# Altium schematic sheet PAGE2-POWER.SchDoc (part 2 of 2)
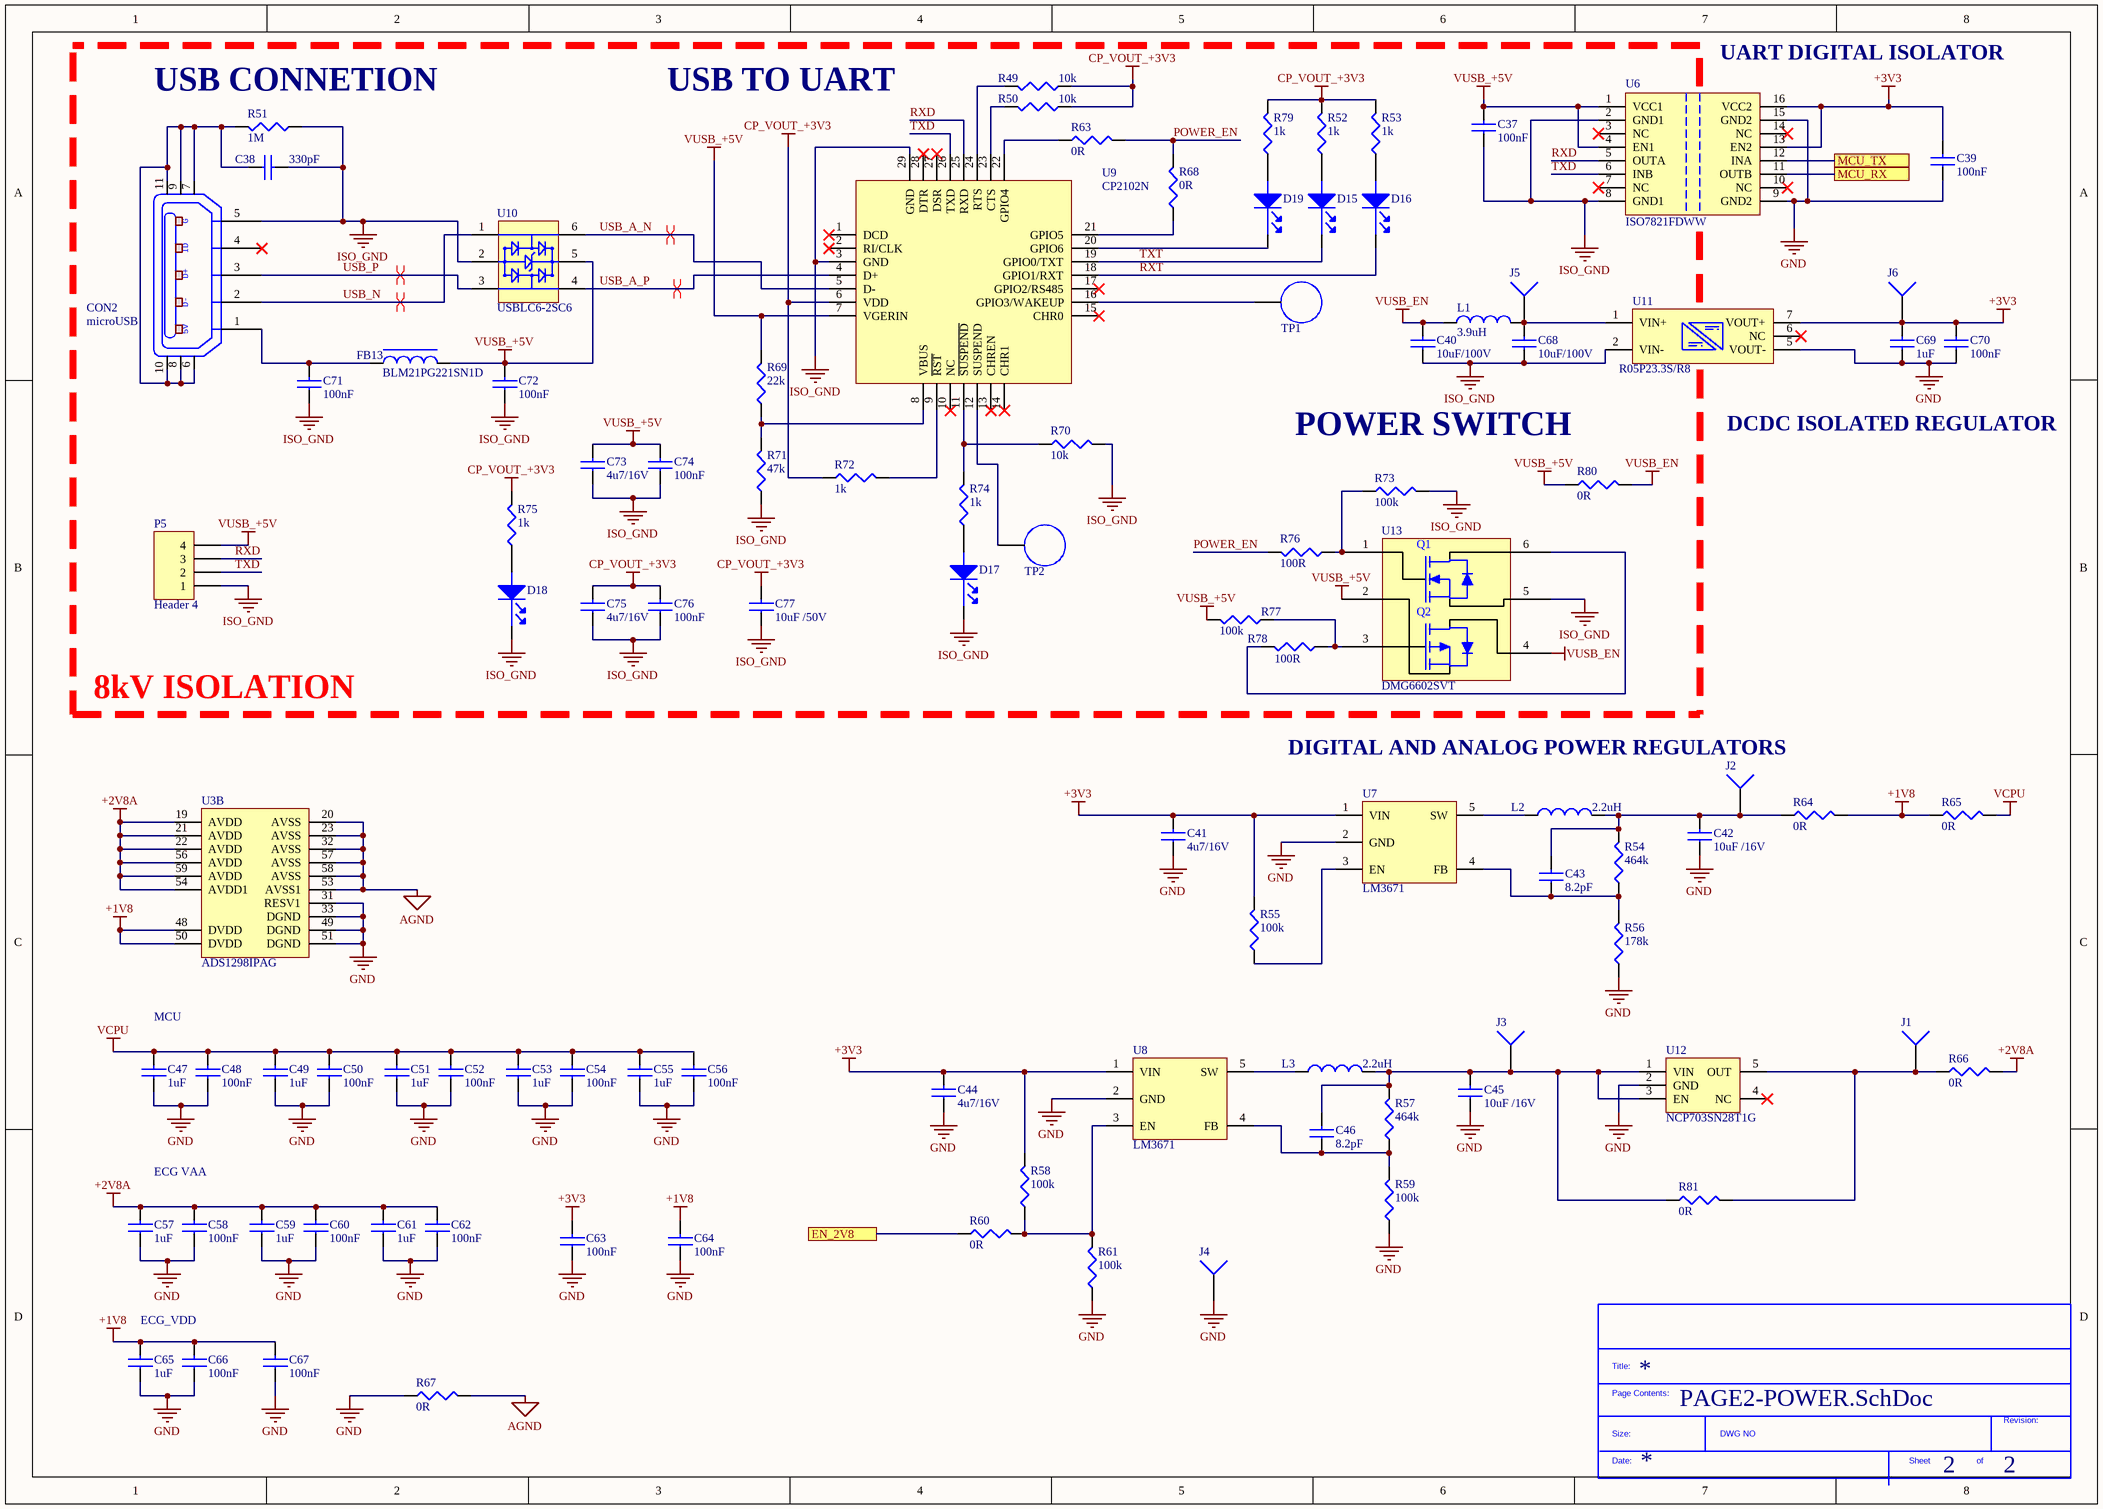
[diagram p1: PAGE2-POWER.SchDoc]

## Library data of the parts
C37 C39 C48 C50 C52 C54 C56 C58 C60 C62-C64 C66 C67 C70-C72 C74 C76 = 100nF: MURATA - GRM188R71C104KA01J - CAP, MLCC, X7R, 0.1UF, 16V, 0603; Ceramic Capacitor Case: 0603 [1608 Metric]; Capacitance: 0.1; Voltage Rating: 16; Capacitance Tolerance: ± 10%; Dielectric Characteristic: X7; Product Range: GRM Series; SVHC: No SVHC (20-Jun-2016; Supplier 1: Farnell; Manufacturer: MURATA; Manufacturer Part Number: GRM188R71C104KA01J; RoHS: YES; Stock 1: 18297; Pricing 1: 10=0.0145, 100=0.0126, 500=0.0081, 2500=0.0059, 5000=0.0052, 10000=0.0046, 50000=0.0036, 100000=0.0035 (GBP); Packaging: Cut Tape; Operating Temperature Min: -55; Operating Temperature Max: 125; Automotive Qualification Standard: -; MSL: MSL 1 - Unlimited; ComponentLink1URL: http://www.farnell.com/datasheets/2189124.pdf; ComponentLink1Description: http://www.farnell.com/datasheets/2189124.pdf; Supplier Part Number 1: 2688519
C38 = 330pF: Cap Ceramic 330pF 50V C0G 5% SMD 0603 125C Paper T/R; Manufacturer: Walsin Technologies; Manufacturer Part Number: 0603N331J500CT; Supplier 1: Farnell; Stock 1: 9688; Pricing 1: 10=0.066, 100=0.0446, 500=0.0195, 1000=0.0138 (GBP); Case/Package: 0603; Case Code (Metric): 1608; Case Code (Imperial): 0603; Min Operating Temperature: -55°C; Max Operating Temperature: 125°C; Packaging: Tape and Reel; Capacitance: 330pF; Tolerance: 5%; Dielectric: C0G; Voltage Rating: 50V; Voltage Rating (DC): 50V; Length: 1.6mm; Depth: 0.8mm; Radiation Hardening: No; REACH SVHC: Unknown; Supplier Part Number 1: 2496902
C40 C68 = 10uF/100V/2220: 10µF 100V Ceramic Capacitor X7R 2220 (5750 Metric) 0.224" L x 0.197" W (5.70mm x 5.00mm); Manufacturer: Kyocera AVX; Manufacturer Part Number: 22201C106MAT2A; Capacitance: 10uF; Tolerance: 20%; Supplier 1: Digi-Key; Stock 1: 5000; Pricing 1: 1=2.58, 10=2.087, 100=1.5939 (USD); Mount: Surface Mount; Case/Package: 2220; Case Code (Metric): 5750; Case Code (Imperial): 2220; Min Operating Temperature: -55°C; Max Operating Temperature: 125°C; Packaging: Tape and Reel; Voltage Rating: 100V; Dielectric: X7R; Voltage Rating (DC): 100V; Length: 0.224inch; Width: 0.197inch; Thickness: 0.11inch; Supplier Part Number 1: 478-9622-6-ND
C41 C44 C73 C75 = 4u7  16V 0603: MURATA - GRM188R61C475KAAJD - CAP, MLCC, X5R, 4.7UF, 16V, 0603; Ceramic Capacitor Case: 0603 [1608 Metric]; Capacitance: 4.7; Voltage Rating: 16; Capacitance Tolerance: ± 10%; Dielectric Characteristic: X5; Product Range: GRM Series; SVHC: No SVHC (17-Dec-2015)<!--FANDB--><div class="features-and-benefits-container"><div class="features-and-benefits-desc-container"><span class="features-and-benefits-container-desc">SMD Multilayer Ceramic Capacitor, 0603 [1608 Metric], 4.7 µF, 16 V, ± 10%, X5; Supplier 1: Farnell; Manufacturer: MURATA; Manufacturer Part Number: GRM188R61C475KAAJD; RoHS: YES; Stock 1: 5038; Pricing 1: 10=0.16, 100=0.0929, 500=0.076, 1000=0.0618, 2000=0.0605, 4000=0.0425, 20000=0.0409, 40000=0.0355 (GBP); Packaging: Cut Tape; Operating Temperature Min: -55; Operating Temperature Max: 85; Automotive Qualification Standard: -; MSL: MSL 1 - Unlimited; ComponentLink1URL: http://www.farnell.com/datasheets/2079168.pdf; ComponentLink1Description: http://www.farnell.com/datasheets/2079168.pdf; Supplier Part Number 1: 2611924
C42 C45 = 10uF /16V: TDK - CGA4J1X5R1C106K125AC - CAP, MLCC, X5R, 10UF, 16V, 0805; Supplier 1: Farnell; Manufacturer: TDK; Manufacturer Part Number: CGA4J1X5R1C106K125AC; RoHS: YES; Stock 1: 8974; Pricing 1: 5=0.41, 50=0.146, 250=0.131, 500=0.12, 1000=0.103 (GBP); ComponentLink1URL: http://bcove.me/e1v54mtm; ComponentLink1Description: http://bcove.me/e1v54mtm; ComponentLink2URL: http://www.farnell.com/datasheets/1936565.pdf; ComponentLink2Description: http://www.farnell.com/datasheets/1936565.pdf; ComponentLink3URL: http://www.farnell.com/datasheets/1683658.pdf; ComponentLink3Description: http://www.farnell.com/datasheets/1683658.pdf; Supplier Part Number 1: 2210948RL
C43 C46 = 8.2pF: CAPACITOR, 0603, 8.2PF, 50V; Manufacturer: Yageo; Manufacturer Part Number: CC0603DRNPO9BN8R2; Dielectric Material: Ceramic; Tolerance: 5%; Temperature Coefficient: 30ppm/°C; Dielectric: C0G; Insulation Resistance: 100GR; Supplier 1: Farnell; Stock 1: 34581; Pricing 1: 10=0.0422, 100=0.0281, 500=0.0211, 1000=0.0169, 2000=0.0141, 4000=0.0121, 20000=0.0077 (EUR); Mount: Surface Mount; Case/Package: 0603; Number of Pins: 2; Case Code (Imperial): 0603; Case Code (Metric): 1608; Min Operating Temperature: -55°C; Max Operating Temperature: 125°C; Packaging: Tape and Reel; Package Quantity: 4000; Termination: SMD/SMT; Voltage Rating: 50V; Composition: Ceramic; Capacitance: 8.2pF; Voltage Rating (DC): 50V; Length: 1.6mm; Height: 0.8mm; Width: 0.8mm; Depth: 0.8mm; Thickness: 0.035inch; Radiation Hardening: No; REACH SVHC: No SVHC; Lead Free: Lead Free; ComponentLink1URL: https://datasheet.ciiva.com/11586/upy-gp-np0-16v-to-50v-8-11586455.pdf; ComponentLink1Description: https://datasheet.ciiva.com/11586/upy-gp-np0-16v-to-50v-8-11586455.pdf; ComponentLink2URL: https://datasheet.ciiva.com/13210/upy-gp-np0-16v-to-50v-8-13210824.pdf; ComponentLink2Description: https://datasheet.ciiva.com/13210/upy-gp-np0-16v-to-50v-8-13210824.pdf; ComponentLink3URL: https://datasheet.ciiva.com/8033/1443161-8033709.pdf; ComponentLink3Description: https://datasheet.ciiva.com/8033/1443161-8033709.pdf; ComponentLink4URL: https://datasheet.ciiva.com/17437/upy-gp-np0-16v-to-50v-8-17437117.pdf; ComponentLink4Description: https://datasheet.ciiva.com/17437/upy-gp-np0-16v-to-50v-8-17437117.pdf; ComponentLink5URL: https://datasheet.ciiva.com/8033/1443161-8033711.pdf; ComponentLink5Description: https://datasheet.ciiva.com/8033/1443161-8033711.pdf; Supplier Part Number 1: 721955
C47 C49 C51 C53 C55 C57 C59 C61 C65 C69 = 1uF: MURATA - GRM188R61H105KAALD - CAP, MLCC, X5R, 1UF, 50V, 0603; Ceramic Capacitor Case: 0603 [1608 Metric]; Capacitance: 1; Voltage Rating: 50; Capacitance Tolerance: ± 10%; Dielectric Characteristic: X5; Product Range: GRM Series; SVHC: No SVHC (17-Dec-2015); Capacitor Terminals: SMD<!--FANDB--><div class="features-and-benefits-container"><div class="features-and-benefits-description"><span class="features-benefits-value">The Murata GRM series capacitors are Multilayer Ceramic Chip Capacitors (MLCC) used for general purpose applications. These MLCC capacitors are classified into temperature compensating and high dielectric constant types depending on the change in electrostatic capacitance due to change in temperature. The temperature compensating capacitors feature a small rate of change in electrostatic capacitance as the temperature changes and are used for applications such as filters and high frequency circuit matching. The high dielectric constant capacitors use materials with a high dielectric constant and feature a large electrostatic capacitance. Typical applications are power supply decoupling and smoothing circuits.</span></div><div class="features-and-benefits-list"><ul class="features-and-benefits-list-list"><li class="features-and-benefits-list-item">Large capacity and small size in a multilayer structure</li><li class="features-and-benefits-list-item">Capacitance value ranging from 0.1pF to 220?F</li><li class="features-and-benefits-list-item">Tin plated external electrodes, excellent solderability</li><li class="features-and-benefits-list-item">Provides good high frequency characteristics</li><li class="features-and-benefits-list-item">Excellent pulse response</li><li class="features-and-benefits-list-item">High reliability</li><li class="features-and-benefits-list-item">Capacitor size varies from 0.4×0.2mm to 5.7×5.0mm</li><li class="features-and-benefits-list-item">Rated voltage of 2.5VDC to 3.15; Supplier 1: Farnell; Manufacturer: MURATA; Manufacturer Part Number: GRM188R61H105KAALD; RoHS: YES; Stock 1: 62682; Pricing 1: 10=0.093, 100=0.062, 500=0.0507, 1000=0.0465, 2000=0.0429, 4000=0.0399, 20000=0.0372, 40000=0.0365 (GBP); Packaging: Cut Tape; Operating Temperature Min: -55; Operating Temperature Max: 85; Automotive Qualification Standard: -; MSL: -; Capacitance Tolerance ±: ± 10%; ComponentLink1URL: http://www.farnell.com/datasheets/2048611.pdf; ComponentLink1Description: http://www.farnell.com/datasheets/2048611.pdf; Supplier Part Number 1: 1845736
C77 = 10uF /50V: MURATA - GRM31CR61H106KA12L - CAP, MLCC, X5R, 10UF, 50V, 1206; Supplier 1: Farnell; Manufacturer: MURATA; Manufacturer Part Number: GRM31CR61H106KA12L; RoHS: YES; Stock 1: 51830; Pricing 1: 5=0.368, 50=0.214, 250=0.196, 500=0.178, 1000=0.159 (GBP); ComponentLink1URL: http://www.farnell.com/datasheets/2048767.pdf; ComponentLink1Description: http://www.farnell.com/datasheets/2048767.pdf; Supplier Part Number 1: 1845762
CON2 = Micro USB CHINA 1
D15-D19 = LED RED: BROADCOM LIMITED - HSMS-C190 - LED, RED, 10MCD, 626NM; LED Mounting: SMD; Forward Current If: 20; Forward Voltage: 2.1; Wavelength Typ: 626; Luminous Intensity: 10; Viewing Angle: 170°; Lens Shape: Rectangular; SVHC: No SVHC (17-Dec-2015)<!--FANDB--><div class="features-and-benefits-container"><div class="features-and-benefits-description"><span class="features-benefits-value">The HSMS-C190 is a HER SMD Chip LED with untinted/diffused lens, made of GaP. It is designed in an industry standard package 1.6 x 0.8mm footprint with 0.8mm profile. It is compatible with IR reflow solder processes. The small size and wide viewing angle make this LED prime choices for backlighting applications and front panel illumination especially where space is a premium.</span></div><div class="features-and-benefits-list"><ul class="features-and-benefits-list-list"><li class="features-and-benefits-list-item">Small size</li><li class="features-and-benefits-list-item">Industry standard footprint</li><li class="features-and-benefits-list-item">Compatible with IR solder</li><li class="features-and-benefits-list-item">Diffused optics</li><li class="features-and-benefits-list-item">-40 to 85; Supplier 1: Farnell; Manufacturer: BROADCOM LIMITED; Manufacturer Part Number: HSMS-C190; RoHS: YES; Stock 1: 7534; Pricing 1: 1=0.361, 10=0.256, 50=0.235, 100=0.106, 200=0.101 (GBP); LED Colour: Red; Bulb Size: -; Packaging: Cut Tape; Product Range: -; Automotive Qualification Standard: -; MSL: -; ComponentLink1URL: http://www.farnell.com/datasheets/313031.pdf; ComponentLink1Description: http://www.farnell.com/datasheets/313031.pdf; ComponentLink2URL: http://www.farnell.com/datasheets/1681524.pdf; ComponentLink2Description: http://www.farnell.com/datasheets/1681524.pdf; ComponentLink3URL: http://www.farnell.com/datasheets/2165483.pdf; ComponentLink3Description: http://www.farnell.com/datasheets/2165483.pdf; Supplier Part Number 1: 2497356
FB13 = BLM21PG221SN1D: FERRITE CHIP 220 OHM 0805; Manufacturer: Murata; Material: Ferrite,Steel; Impedance: 220R; Tolerance: 25%; Max Current Rating: 2A; Number of Lines: 1; DC Resistance (DCR): 45mR; Test Frequency: 100MHz; Shielding: Unshielded; Supplier 1: Farnell; Manufacturer Part Number: BLM21PG221SN1D; Stock 1: 8102; Pricing 1: 10=0.0521, 100=0.0337, 500=0.0251, 1000=0.0207, 2000=0.0196, 4000=0.0156, 20000=0.0145 (GBP); Case/Package: 0805; Number of Pins: 2; Core Material: Ferrite; Case Code (Metric): 2012; Case Code (Imperial): 0805; Contact Plating: Matte,Tin; Min Operating Temperature: -55°C; Max Operating Temperature: 125°C; Package Quantity: 1; Packaging: Tape and Reel; Current Rating: 2A; Max DC Current: 2A; Termination: SMD/SMT; DC Current: 2A; Military Standard: Not; Frequency: 100MHz; Number of Circuits: 1; Current: 2A; Length: 2mm; Height: 0.85mm; Width: 1.25mm; Depth: 1.25mm; Radiation Hardening: No; REACH SVHC: No SVHC; Lead Free: Lead Free; ComponentLink1URL: https://www.murata.com/en-us/products/productdata/8796738977822/ENFA0005.pdf; ComponentLink1Description: https://www.murata.com/en-us/products/productdata/8796738977822/ENFA0005.pdf; ComponentLink2URL: http://uk.rs-online.com/webdocs/1388/0900766b813885e8.pdf; ComponentLink2Description: http://uk.rs-online.com/webdocs/1388/0900766b813885e8.pdf; ComponentLink3URL: https://www.distrelec.biz/Web/Downloads/ta/_e/anBLM21P_Data_E.pdf?mime=application%2Fpdf; ComponentLink3Description: https://www.distrelec.biz/Web/Downloads/ta/_e/anBLM21P_Data_E.pdf?mime=application%2Fpdf; ComponentLink4URL: http://search.murata.co.jp/Ceramy/image/img/PDF/ENG/L0110S0100BLM21P.pdf; ComponentLink4Description: http://search.murata.co.jp/Ceramy/image/img/PDF/ENG/L0110S0100BLM21P.pdf; ComponentLink5URL: http://www.farnell.com/datasheets/1756152.pdf; ComponentLink5Description: http://www.farnell.com/datasheets/1756152.pdf; ComponentLink6URL: http://www.jameco.com/Jameco/Products/ProdDS/1845321.pdf; ComponentLink6Description: http://www.jameco.com/Jameco/Products/ProdDS/1845321.pdf; ComponentLink7URL: http://www.produktinfo.conrad.com/datenblaetter/425000-449999/442529-da-01-en-CHIP_DROSSEL_0805_220R_2000MA_2_0X1_25MM.pdf; ComponentLink7Description: http://www.produktinfo.conrad.com/datenblaetter/425000-449999/442529-da-01-en-CHIP_DROSSEL_0805_220R_2000MA_2_0X1_25MM.pdf; Supplier Part Number 1: 1515661
L1 = 3.9uH/1.32A: WURTH ELEKTRONIK         7440450039             Surface Mount Power Inductor, WE-LQ Series, 3.9 H, 1.32 A, 2.5 A, Unshielded, 0.14 ohm; Manufacturer: Wurth Electronics; Core Material: Ferrite; Inductance Tolerance: 20%; Q Factor: 40; Self Resonant Frequency: 54MHz; Current Rating: 1.32A; Saturation Current: 2.5A; DC Resistance (DCR): 140mR; Test Frequency: 1MHz; Supplier 1: Digi-Key; Manufacturer Part Number: 7440450039; Stock 1: 541; Pricing 1: 1=0.8, 10=0.786, 50=0.728, 100=0.67, 250=0.612 (USD); Mount: Surface Mount; Case/Package: 1812; Case Code (Metric): 4532; Case Code (Imperial): 1812; Min Operating Temperature: -40°C; Max Operating Temperature: 125°C; Package Quantity: 1; Tolerance: 20%; Shielding: Unshielded; Packaging: Cut Tape; Composition: Wirewound; Inductance: 3.9uh; Max DC Current: 1.32A; Termination: SMD/SMT; RMS Current (Irms): 1.32A; Length: 0.177inch; Height: 2.6mm; Width: 0.126inch; Height - Seated (Max): 0.114inch; REACH SVHC: Unknown; ComponentLink1URL: http://www.farnell.com/datasheets/1735423.pdf; ComponentLink1Description: http://www.farnell.com/datasheets/1735423.pdf; ComponentLink2URL: http://katalog.we-online.de/pbs/datasheet/7440450039.pdf; ComponentLink2Description: http://katalog.we-online.de/pbs/datasheet/7440450039.pdf; ComponentLink3URL: http://www.mouser.com/ds/2/445/7440450039-538340.pdf; ComponentLink3Description: http://www.mouser.com/ds/2/445/7440450039-538340.pdf; Supplier Part Number 1: 732-4063-1-ND
L2 L3 = 2.2 uH 900mA: Manufacturer: Bourns; Manufacturer Part Number: SRN2009T-2R2M; Supplier 1: Farnell; Stock 1: 1975; Pricing 1: 5=0.308, 50=0.201, 250=0.163, 500=0.145, 1000=0.133, 2000=0.124, 10000=0.116 (EUR); Supplier Part Number 1: 2808272
P5 = Header 4: Header, 4-Pin; LatestRevisionDate: 17-Jul-2002; LatestRevisionNote: Re-released for DXP Platform.; Publisher: Altium Limited
R49 R50 R70 = 10k: MULTICOMP - MCMR06X103 JTL - RES, CERAMIC, 10K, 5%, 0.1W, 0603; Resistance: 10; Voltage Rating: 75; Resistor Case Style: 0603 [1608 Metric]; Power Rating: 100; Product Range: MCMR Series; Temperature Coefficient: ± 100; Automotive Qualification Standard: -<!--FANDB--><div class="features-and-benefits-container"><div class="features-and-benefits-description"><span class="features-benefits-value">The Multicomp MCMR series resistors are automotive grade, anti sulphured thick film chip resistor. The resistance range includes E24 and E96 decade values from 1ohm to 10Mohm. These resistors are constructed on top of a high grade ceramic body.</span></div><div class="features-and-benefits-list"><ul class="features-and-benefits-list-list"><li class="features-and-benefits-list-item">EIA 0402, 0603, 0805, 1206 chip sizes available</li><li class="features-and-benefits-list-item">High reliability and stability</li><li class="features-and-benefits-list-item">Automotive grade AEC-Q200 compliant</li><li class="features-and-benefits-list-item">Complaint with (IEC 60068-1) 55/155/56 climatic category</li><li class="features-and-benefits-list-item">Maximum operation voltage of 50V, 75V, 150V and 200V</li><li class="features-and-benefits-list-item">Power rating of 62.5mW, 100mW, 125mW and 250mW</li><li class="features-and-benefits-list-item">Available in ±1% and ±5% tolerance</li><li class="features-and-benefits-list-item">Temperature coefficient (TCR) of +200ppm/°C, +100ppm/°C and -200ppm/°C to +400ppm/°C</li><li class="features-and-benefits-list-item">Operating temperature range -55°C to 155; Supplier 1: Farnell; Manufacturer: MULTICOMP; Manufacturer Part Number: MCMR06X103 JTL; RoHS: Y-EX; Stock 1: 19791; Pricing 1: 10=0.0087, 100=0.0074, 500=0.0061, 1000=0.0048, 2500=0.0032, 5000=0.0024, 25000=0.0016, 50000=0.0013 (GBP); Resistance Tolerance: ± 5%; Packaging: Cut Tape; Resistor Element Material: Ceramic; ComponentLink1URL: http://www.farnell.com/datasheets/1716707.pdf; ComponentLink1Description: http://www.farnell.com/datasheets/1716707.pdf; Supplier Part Number 1: 2073356
R51 = 1M: MULTICOMP - MC0063W060311M - RES, THICK FILM, 1M, 1%, 0.063W, 0603; Resistance: 1; Voltage Rating: 50; Resistor Case Style: 0603 [1608 Metric]; Power Rating: 63; Product Range: MC Series; Temperature Coefficient: ± 100; SVHC: No SVHC (17-Dec-2015); External Depth: 0.45; External Length / Height: 1.6; External Width: 0.8; No. of Pins: 2; Reel Quantity: 5000; Resistor Mounting: Surface Mount Device; Temperature Coeff. +: 100; Voltage Rating V DC: 50V<!--FANDB--><div class="features-and-benefits-container"><div class="features-and-benefits-description"><span class="features-benefits-value">The Multicomp MC series current sense resistors are thick film chip resistors. The resistance range includes E96 and E24 decade values from 1ohm to 10Mohm.</span></div><div class="features-and-benefits-list"><ul class="features-and-benefits-list-list"><li class="features-and-benefits-list-item">EIA 0402, 0603, 0805, 1206 chip sizes available</li><li class="features-and-benefits-list-item">Small size and low weight</li><li class="features-and-benefits-list-item">Suitable for both wave and reflow soldering</li><li class="features-and-benefits-list-item">Reduction of assembly costs</li><li class="features-and-benefits-list-item">Maximum working voltage of 50V(0402, 0603), 150V(0805), 200V(1206)</li><li class="features-and-benefits-list-item">Available in ±1%, ±2% and ±5% tolerance</li><li class="features-and-benefits-list-item">Power rating of 62.5mW, 100mW and 125mW</li><li class="features-and-benefits-list-item">±400ppm/°C(1ohm to 10ohm), ±200ppm/°C(11ohm to 100ohm), ±100; Supplier 1: Farnell; Manufacturer: MULTICOMP; Manufacturer Part Number: MC0063W060311M; RoHS: Y-EX; Stock 1: 333415; Pricing 1: 10=0.0011, 100=0.001, 500=0.0009, 1000=0.0008, 2500=0.0007 (GBP); Resistance Tolerance: ± 1%; Packaging: Cut Tape; Resistor Element Material: Thick Film; Automotive Qualification Standard: -; Operating Temperature Max: 155; Operating Temperature Min: -55; Operating Temperature Range: -55°C to +155; Tape Width: 8; Temperature Coeff. -: 100; Tolerance +: 1%; Tolerance -: 1%; ComponentLink1URL: http://www.farnell.com/datasheets/1788326.pdf; ComponentLink1Description: http://www.farnell.com/datasheets/1788326.pdf; ComponentLink2URL: http://www.farnell.com/cad/1558928.zip; ComponentLink2Description: http://www.farnell.com/cad/1558928.zip; Supplier Part Number 1: 9330410
R52 R53 R72 R74 R75 R79 = 1k: MULTICOMP - MCMR06X102 JTL - RES, CERAMIC, 1K, 5%, 0.1W, 0603; Resistance: 1; Voltage Rating: 75; Resistor Case Style: 0603 [1608 Metric]; Power Rating: 100; Product Range: MCMR Series; Temperature Coefficient: ± 100; Resistor Mounting: Surface Mount Device<!--FANDB--><div class="features-and-benefits-container"><div class="features-and-benefits-description"><span class="features-benefits-value">The Multicomp MCMR series resistors are automotive grade, anti sulphured thick film chip resistor. The resistance range includes E24 and E96 decade values from 1ohm to 10Mohm. These resistors are constructed on top of a high grade ceramic body.</span></div><div class="features-and-benefits-list"><ul class="features-and-benefits-list-list"><li class="features-and-benefits-list-item">EIA 0402, 0603, 0805, 1206 chip sizes available</li><li class="features-and-benefits-list-item">High reliability and stability</li><li class="features-and-benefits-list-item">Automotive grade AEC-Q200 compliant</li><li class="features-and-benefits-list-item">Complaint with (IEC 60068-1) 55/155/56 climatic category</li><li class="features-and-benefits-list-item">Maximum operation voltage of 50V, 75V, 150V and 200V</li><li class="features-and-benefits-list-item">Power rating of 62.5mW, 100mW, 125mW and 250mW</li><li class="features-and-benefits-list-item">Available in ±1% and ±5% tolerance</li><li class="features-and-benefits-list-item">Temperature coefficient (TCR) of +200ppm/°C, +100ppm/°C and -200ppm/°C to +400ppm/°C</li><li class="features-and-benefits-list-item">Operating temperature range -55°C to 155; Supplier 1: Farnell; Manufacturer: MULTICOMP; Manufacturer Part Number: MCMR06X102 JTL; RoHS: Y-EX; Stock 1: 18133; Pricing 1: 10=0.0089, 100=0.0076, 500=0.0063, 1000=0.0049, 2500=0.0033, 5000=0.0024, 25000=0.0016, 50000=0.0013 (GBP); Resistance Tolerance: ± 5%; Packaging: Cut Tape; Resistor Element Material: Ceramic; Automotive Qualification Standard: -; ComponentLink1URL: http://www.farnell.com/datasheets/1716707.pdf; ComponentLink1Description: http://www.farnell.com/datasheets/1716707.pdf; Supplier Part Number 1: 2073354
R54 R57 = 464k: RES SMD 464K OHM 1% 1/10W 0603; Manufacturer: Vishay; Manufacturer Part Number: CRCW0603464KFKEA; Power Rating: 100mW; Voltage Rating: 75V; Resistance: 464kR; Temperature Coefficient: 100ppm/°C; Supplier 1: Farnell; Stock 1: 8300; Pricing 1: 10=0.0269, 100=0.0188, 500=0.0139, 1000=0.0081, 2500=0.0063 (EUR); Case/Package: 0603; Number of Pins: 2; Weight: 7.1E-05oz; Case Code (Metric): 1608; Case Code (Imperial): 0603; Contact Plating: Tin; Min Operating Temperature: -55°C; Max Operating Temperature: 155°C; Packaging: Tape and Reel; Package Quantity: 10; Termination: SMD/SMT; Tolerance: 1%; Composition: Thick Film; Number of Terminations: 2; Military Standard: Not; Max Power Dissipation: 100mW; Length: 1.55mm; Height: 0.45mm; Width: 0.033inch; Depth: 0.85mm; Radiation Hardening: No; REACH SVHC: Unknown; ComponentLink1URL: https://datasheet.ciiva.com/11812/0900766b80d98afc-11812357.pdf; ComponentLink1Description: https://datasheet.ciiva.com/11812/0900766b80d98afc-11812357.pdf; ComponentLink2URL: https://datasheet.ciiva.com/2466/dcrcwe3-2466323.pdf; ComponentLink2Description: https://datasheet.ciiva.com/2466/dcrcwe3-2466323.pdf; ComponentLink3URL: https://datasheet.ciiva.com/2466/dcrcwe3-2466324.pdf; ComponentLink3Description: https://datasheet.ciiva.com/2466/dcrcwe3-2466324.pdf; ComponentLink4URL: https://datasheet.ciiva.com/2466/dcrcwe3-2466325.pdf; ComponentLink4Description: https://datasheet.ciiva.com/2466/dcrcwe3-2466325.pdf; ComponentLink5URL: https://datasheet.ciiva.com/16893/dcrcwe3-16893397.pdf; ComponentLink5Description: https://datasheet.ciiva.com/16893/dcrcwe3-16893397.pdf; ComponentLink6URL: https://datasheet.ciiva.com/5545/dcrcwe3-109170-5545738.pdf; ComponentLink6Description: https://datasheet.ciiva.com/5545/dcrcwe3-109170-5545738.pdf; ComponentLink7URL: https://datasheet.ciiva.com/22708/1697337-22708075.pdf; ComponentLink7Description: https://datasheet.ciiva.com/22708/1697337-22708075.pdf; ComponentLink8URL: https://datasheet.ciiva.com/3257/dcrcwe3-3257612.pdf; ComponentLink8Description: https://datasheet.ciiva.com/3257/dcrcwe3-3257612.pdf; ComponentLink9URL: https://datasheet.ciiva.com/3257/dcrcwe3-3257613.pdf; ComponentLink9Description: https://datasheet.ciiva.com/3257/dcrcwe3-3257613.pdf; ComponentLink10URL: https://datasheet.ciiva.com/7670/1697337-7670829.pdf; ComponentLink10Description: https://datasheet.ciiva.com/7670/1697337-7670829.pdf; ComponentLink11URL: https://datasheet.ciiva.com/7670/1697337-7670830.pdf; ComponentLink11Description: https://datasheet.ciiva.com/7670/1697337-7670830.pdf; ComponentLink12URL: https://datasheet.ciiva.com/7792/125364-7792286.pdf; ComponentLink12Description: https://datasheet.ciiva.com/7792/125364-7792286.pdf; Supplier Part Number 1: 2138565
R55 R58 R59 R61 R73 R77 = 100k: MULTICOMP - MCMR06X104 JTL - RES, CERAMIC, 100K, 5%, 0.1W, 0603; Resistance: 100; Voltage Rating: 75; Resistor Case Style: 0603 [1608 Metric]; Product Range: MCMR Series; Temperature Coefficient: ± 100; Resistor Mounting: Surface Mount Device<!--FANDB--><div class="features-and-benefits-container"><div class="features-and-benefits-description"><span class="features-benefits-value">The Multicomp MCMR series resistors are automotive grade, anti sulphured thick film chip resistor. The resistance range includes E24 and E96 decade values from 1ohm to 10Mohm. These resistors are constructed on top of a high grade ceramic body.</span></div><div class="features-and-benefits-list"><ul class="features-and-benefits-list-list"><li class="features-and-benefits-list-item">EIA 0402, 0603, 0805, 1206 chip sizes available</li><li class="features-and-benefits-list-item">High reliability and stability</li><li class="features-and-benefits-list-item">Automotive grade AEC-Q200 compliant</li><li class="features-and-benefits-list-item">Complaint with (IEC 60068-1) 55/155/56 climatic category</li><li class="features-and-benefits-list-item">Maximum operation voltage of 50V, 75V, 150V and 200V</li><li class="features-and-benefits-list-item">Power rating of 62.5mW, 100mW, 125mW and 250mW</li><li class="features-and-benefits-list-item">Available in ±1% and ±5% tolerance</li><li class="features-and-benefits-list-item">Temperature coefficient (TCR) of +200ppm/°C, +100ppm/°C and -200ppm/°C to +400ppm/°C</li><li class="features-and-benefits-list-item">Operating temperature range -55°C to 155; Supplier 1: Farnell; Manufacturer: MULTICOMP; Manufacturer Part Number: MCMR06X104 JTL; RoHS: Y-EX; Stock 1: 187; Pricing 1: 10=0.0109, 100=0.0085, 500=0.006, 1000=0.0048, 2500=0.004, 5000=0.003, 25000=0.002, 50000=0.0016 (GBP); Power Rating: 100; Resistance Tolerance: ± 5%; Packaging: Cut Tape; Resistor Element Material: Ceramic; Automotive Qualification Standard: -; ComponentLink1URL: http://www.farnell.com/datasheets/1716707.pdf; ComponentLink1Description: http://www.farnell.com/datasheets/1716707.pdf; Supplier Part Number 1: 2073357
R56 = 178k: PANASONIC ELECTRONIC COMPONENTS         ERJ3EKF1783V             SMD Chip Resistor, Thick Film, 178 kohm, 75 V, 0603 [1608 Metric], 100 mW,  1%, ERJ3E Series; Manufacturer Part Number: ERJ-3EKF1783V; Resistance: 178kR; Power Rating: 100mW; Voltage Rating: 75V; Temperature Coefficient: 100ppm/°C; Voltage Rating (DC): 50V; Supplier 1: Farnell; Manufacturer: Panasonic; Stock 1: 86238; Pricing 1: 10=0.0416, 100=0.0243, 500=0.018, 1000=0.0161, 2500=0.0142 (EUR); Mount: Surface Mount; Case/Package: 0603; Case Code (Imperial): 0603; Case Code (Metric): 1608; Contact Plating: Tin; Min Operating Temperature: -55°C; Max Operating Temperature: 155°C; Tolerance: 1%; Packaging: Tape and Reel; Package Quantity: 1; Termination: SMD/SMT; Composition: Thick Film; Number of Terminations: 2; Military Standard: Not; Max Power Dissipation: 100mW; Length: 1.6mm; Height: 0.45mm; Width: 0.8mm; Depth: 0.8mm; REACH SVHC: No SVHC; Lead Free: Lead Free; ComponentLink1URL: https://datasheet.ciiva.com/5870/426256-5870791.pdf; ComponentLink1Description: https://datasheet.ciiva.com/5870/426256-5870791.pdf; ComponentLink2URL: https://datasheet.ciiva.com/46389/426256-46389225.pdf; ComponentLink2Description: https://datasheet.ciiva.com/46389/426256-46389225.pdf; ComponentLink3URL: https://datasheet.ciiva.com/30063/aoa0000ce2-30063354.pdf; ComponentLink3Description: https://datasheet.ciiva.com/30063/aoa0000ce2-30063354.pdf; ComponentLink4URL: https://datasheet.ciiva.com/9185/aoa0000ce2-9185004.pdf; ComponentLink4Description: https://datasheet.ciiva.com/9185/aoa0000ce2-9185004.pdf; ComponentLink5URL: https://datasheet.ciiva.com/9185/aoa0000ce2-9185020.pdf; ComponentLink5Description: https://datasheet.ciiva.com/9185/aoa0000ce2-9185020.pdf; ComponentLink6URL: https://datasheet.ciiva.com/16788/70260748-16788300.pdf; ComponentLink6Description: https://datasheet.ciiva.com/16788/70260748-16788300.pdf; ComponentLink7URL: https://datasheet.ciiva.com/28694/1678782-28694447.pdf; ComponentLink7Description: https://datasheet.ciiva.com/28694/1678782-28694447.pdf; Supplier Part Number 1: 2059507
R60 R63-R68 R80 R81 = 0R: BOURNS - CR0603-J/-000ELF - RES, THICK FILM, 0R, 5%, 0.1W, 0603; Resistance: 0; Voltage Rating: 50; Resistor Case Style: 0603 [1608 Metric]; Power Rating: 100; Product Range: CR Series; SVHC: No SVHC (17-Dec-2015); Resistor Mounting: Surface Mount Device<!--FANDB--><div class="features-and-benefits-container"><div class="features-and-benefits-description"><span class="features-benefits-value">The Bourns CR series are standard thick film chip resistors. These resistors provide flexibility of performance, space saving and low cost. The Resistance range includes E96 and E24 decade values from 1ohm to 10Mohm.</span></div><div class="features-and-benefits-list"><ul class="features-and-benefits-list-list"><li class="features-and-benefits-list-item">0201, 0402, 0603, 0805, 1206, 1210, 2010, 2512 standard case sizes available</li><li class="features-and-benefits-list-item">±1% and ±5% tolerance</li><li class="features-and-benefits-list-item">±100ppm/°C, ±200ppm/°C and ±250ppm/°C TCR values available</li><li class="features-and-benefits-list-item">Power rating selectable for 50mW, 63mW, 0.1W, 0.125W, 0.25W, 0.5W and 1W based on ordering</li><li class="features-and-benefits-list-item">Jumpers are available for all size</li><li class="features-and-benefits-list-item">3 layer termination process with nickel barrier prevents leaching & provides excellent solderability</li><li class="features-and-benefits-list-item">Suitable for all type of soldering processes</li><li class="features-and-benefits-list-item">Tight dimensional tolerances</li><li class="features-and-benefits-list-item">Maximum working voltage depends on case size</li><li class="features-and-benefits-list-item">Operating temperature of -55°C to +125°C(CR0201) and -55°C to +155; Supplier 1: Farnell; Manufacturer: BOURNS; Manufacturer Part Number: CR0603-J/-000ELF; RoHS: YES; Stock 1: 58200; Pricing 1: 10=0.0146, 250=0.0097, 1000=0.0073, 5000=0.0049, 12500=0.0042 (GBP); Resistance Tolerance: ± 5%; Packaging: Cut Tape; Resistor Element Material: Thick Film; Temperature Coefficient: -; Automotive Qualification Standard: -; MSL: MSL 1 - Unlimited; ComponentLink1URL: http://www.bourns.com/engineering/CHPREZTR/cr0603.stp; ComponentLink1Description: http://www.bourns.com/engineering/CHPREZTR/cr0603.stp; ComponentLink2URL: http://www.farnell.com/datasheets/2178762.pdf; ComponentLink2Description: http://www.farnell.com/datasheets/2178762.pdf; Supplier Part Number 1: 2008343
R69 = 22k: RES SMD 22K OHM 1% 1/10W 0603; Manufacturer: Vishay; Manufacturer Part Number: CRCW060322K0FKEA; Resistance: 22kR; Power Rating: 100mW; Voltage Rating: 75V; Temperature Coefficient: 100ppm/°C; Supplier 1: Farnell; Stock 1: 19963; Pricing 1: 10=0.0152, 250=0.0101, 1000=0.0063, 5000=0.0049 (GBP); Mount: Surface Mount; Case/Package: 0603; Weight: 7.1E-05oz; Case Code (Imperial): 0603; Case Code (Metric): 1608; Contact Plating: Tin; Min Operating Temperature: -55°C; Max Operating Temperature: 155°C; Composition: Thick Film; Tolerance: 1%; Packaging: Tape and Reel; Package Quantity: 10; Number of Terminations: 2; Military Standard: Not; Termination: SMD/SMT; Max Power Dissipation: 100mW; Voltage Rating (DC): 75V; Features: Automotive AEC-Q200; Length: 1.55mm; Height: 0.45mm; Width: 0.85mm; Depth: 0.85mm; Radiation Hardening: No; REACH SVHC: Unknown; Lead Free: Lead Free; ComponentLink1URL: http://uk.rs-online.com/webdocs/0d98/0900766b80d98afc.pdf; ComponentLink1Description: http://uk.rs-online.com/webdocs/0d98/0900766b80d98afc.pdf; ComponentLink2URL: https://www.verical.com/server-webapp/html/getDatasheet?partID=32846; ComponentLink2Description: https://www.verical.com/server-webapp/html/getDatasheet?partID=32846; ComponentLink3URL: http://www.vishay.com/docs/20035/dcrcwe3.pdf; ComponentLink3Description: http://www.vishay.com/docs/20035/dcrcwe3.pdf; ComponentLink4URL: http://www.farnell.com/datasheets/2045673.pdf; ComponentLink4Description: http://www.farnell.com/datasheets/2045673.pdf; ComponentLink5URL: http://www.farnell.com/datasheets/2111203.pdf; ComponentLink5Description: http://www.farnell.com/datasheets/2111203.pdf; ComponentLink6URL: https://www.alliedelec.com/m/d/0c934d6939ccefa68dbe0b96d821c8cf.pdf; ComponentLink6Description: https://www.alliedelec.com/m/d/0c934d6939ccefa68dbe0b96d821c8cf.pdf; ComponentLink7URL: https://www.distrelec.biz/Web/Downloads/a_/en/flD-CRCW-e3_data_en.pdf?mime=application%2Fpdf; ComponentLink7Description: https://www.distrelec.biz/Web/Downloads/a_/en/flD-CRCW-e3_data_en.pdf?mime=application%2Fpdf; Supplier Part Number 1: 1469779
R71 = 47k: MULTICOMP - MCMR06X4702FTL - RES, CERAMIC, 47K, 1%, 0.1W, 0603; Resistance: 47; Voltage Rating: 75; Resistor Case Style: 0603 [1608 Metric]; Power Rating: 100; Product Range: MCMR Series; Temperature Coefficient: ± 100; Automotive Qualification Standard: -<!--FANDB--><div class="features-and-benefits-container"><div class="features-and-benefits-description"><span class="features-benefits-value">The Multicomp MCMR series resistors are automotive grade, anti sulphured thick film chip resistor. The resistance range includes E24 and E96 decade values from 1ohm to 10Mohm. These resistors are constructed on top of a high grade ceramic body.</span></div><div class="features-and-benefits-list"><ul class="features-and-benefits-list-list"><li class="features-and-benefits-list-item">EIA 0402, 0603, 0805, 1206 chip sizes available</li><li class="features-and-benefits-list-item">High reliability and stability</li><li class="features-and-benefits-list-item">Automotive grade AEC-Q200 compliant</li><li class="features-and-benefits-list-item">Complaint with (IEC 60068-1) 55/155/56 climatic category</li><li class="features-and-benefits-list-item">Maximum operation voltage of 50V, 75V, 150V and 200V</li><li class="features-and-benefits-list-item">Power rating of 62.5mW, 100mW, 125mW and 250mW</li><li class="features-and-benefits-list-item">Available in ±1% and ±5% tolerance</li><li class="features-and-benefits-list-item">Temperature coefficient (TCR) of +200ppm/°C, +100ppm/°C and -200ppm/°C to +400ppm/°C</li><li class="features-and-benefits-list-item">Operating temperature range -55°C to 155; Supplier 1: Farnell; Manufacturer: MULTICOMP; Manufacturer Part Number: MCMR06X4702FTL; RoHS: Y-EX; Stock 1: 21427; Pricing 1: 10=0.0115, 100=0.009, 500=0.0064, 1000=0.0051, 2500=0.0042, 5000=0.0032, 25000=0.0021, 50000=0.0017 (GBP); Resistance Tolerance: ± 1%; Packaging: Cut Tape; Resistor Element Material: Ceramic; ComponentLink1URL: http://www.farnell.com/datasheets/1716707.pdf; ComponentLink1Description: http://www.farnell.com/datasheets/1716707.pdf; Supplier Part Number 1: 2073510
R76 R78 = 100R: MULTICOMP - MC0063W06031100R - RES, THICK FILM, 100R, 1%, 0.063W, 0603; Resistance: 100; Voltage Rating: 50; Resistor Case Style: 0603 [1608 Metric]; Power Rating: 63; Product Range: MC Series; Temperature Coefficient: ± 200; SVHC: No SVHC (12-Jan-2017); External Depth: 0.45; External Length / Height: 1.6; External Width: 0.8; No. of Pins: 2; Reel Quantity: 5000; Resistor Mounting: Surface Mount Device; Temperature Coeff. +: 200; Voltage Rating V DC: 50V<!--FANDB--><div class="features-and-benefits-container"><div class="features-and-benefits-description"><span class="features-benefits-value">The Multicomp MC series current sense resistors are thick film chip resistors. The resistance range includes E96 and E24 decade values from 1ohm to 10Mohm.</span></div><div class="features-and-benefits-list"><ul class="features-and-benefits-list-list"><li class="features-and-benefits-list-item">EIA 0402, 0603, 0805, 1206 chip sizes available</li><li class="features-and-benefits-list-item">Small size and low weight</li><li class="features-and-benefits-list-item">Suitable for both wave and reflow soldering</li><li class="features-and-benefits-list-item">Reduction of assembly costs</li><li class="features-and-benefits-list-item">Maximum working voltage of 50V(0402, 0603), 150V(0805), 200V(1206)</li><li class="features-and-benefits-list-item">Available in ±1%, ±2% and ±5% tolerance</li><li class="features-and-benefits-list-item">Power rating of 62.5mW, 100mW and 125mW</li><li class="features-and-benefits-list-item">±400ppm/°C(1ohm to 10ohm), ±200ppm/°C(11ohm to 100ohm), ±100; Manufacturer: MULTICOMP; Manufacturer Part Number: MC0063W06031100R; RoHS: Y-EX; Resistance Tolerance: ± 1%; Packaging: Cut Tape; Resistor Element Material: Thick Film; Automotive Qualification Standard: -; Operating Temperature Max: 155; Operating Temperature Min: -55; Operating Temperature Range: -55°C to +155; Tape Width: 8; Temperature Coeff. -: 200; Tolerance +: 1%; Tolerance -: 1%; ComponentLink1URL: http://www.farnell.com/datasheets/1788326.pdf; ComponentLink1Description: http://www.farnell.com/datasheets/1788326.pdf; ComponentLink2URL: http://www.farnell.com/cad/1561149.zip; ComponentLink2Description: http://www.farnell.com/cad/1561149.zip; ComponentLink3URL: http://www.farnell.com/datasheets/2289252.pdf; ComponentLink3Description: http://www.farnell.com/datasheets/2289252.pdf; Supplier 1: Farnell; Supplier Part Number 1: 2447227
U3 = ADS1298IPAG: TEXAS INSTRUMENTS   ADS1298IPAG.   ANALOG FRONT END, 24 BIT, 100KHZ, TQFP-64; Number of Channels: 8; Max Power Dissipation: 8.8mW; Max Supply Voltage: 5.25V; Min Supply Voltage: 2.7V; Interface: SPI; Resolution: 24b; Number of Bits: 24; Sampling Rate: 32KS/s; Operating Supply Current: 3.1mA; Max Supply Voltage (DC): 3.6V; Min Supply Voltage (DC): 1.65V; Signal to Noise Ratio (SNR): 112dB; Power Consumption: 6mW; Supplier 1: Farnell; Manufacturer: Texas Instruments; Manufacturer Part Number: ADS1298IPAG; Stock 1: 268; Pricing 1: 1=32.95, 5=31.83, 10=30.27, 25=30.11, 50=26.46 (GBP); Case/Package: TQFP; Number of Pins: 64; Contact Plating: Gold; Min Operating Temperature: -40°C; Max Operating Temperature: 85°C; Package Quantity: 160; Number of Converters: 8; Packaging: Tray; Number of A/D Converters: 8; Conversion Rate: 32KS/s; Number of Inputs: 8; Type: General Purpose; Length: 10.2mm; Height: 1.05mm; Width: 10.2mm; Radiation Hardening: No; REACH SVHC: No SVHC; Lead Free: Lead Free; ComponentLink1URL: https://datasheet.ciiva.com/22621/1716507-22621445.pdf; ComponentLink1Description: https://datasheet.ciiva.com/22621/1716507-22621445.pdf; ComponentLink2URL: https://datasheet.ciiva.com/26796/ads1298ipag-26796374.pdf; ComponentLink2Description: https://datasheet.ciiva.com/26796/ads1298ipag-26796374.pdf; ComponentLink3URL: https://datasheet.ciiva.com/1168/1796012-1168139.pdf; ComponentLink3Description: https://datasheet.ciiva.com/1168/1796012-1168139.pdf; ComponentLink4URL: https://datasheet.ciiva.com/25910/ads1294-25910079.pdf; ComponentLink4Description: https://datasheet.ciiva.com/25910/ads1294-25910079.pdf; Supplier Part Number 1: 2323669
U6 = ISO7821FDWW: TEXAS INSTRUMENTS         ISO7821FDWW             Digital Isolator, 100 MBPS, 2 Channel, 11 ns, 2.25 V, 5.5 V, SOIC, 16 Pins; Number of Channels: 2; Channel Type: Unidirectional; Propagation Delay: 16ns; Min Supply Voltage: 2.25V; Max Supply Voltage: 5.5V; Isolated Power: No; Pulse Width Distortion (PWD): 4.6ns; Supplier 1: Digi-Key; Manufacturer: Texas Instruments; Manufacturer Part Number: ISO7821FDWW; Stock 1: 874; Pricing 1: 1=7.92, 10=7.151, 45=6.81822, 135=5.9203, 540=5.1553, 1035=4.4901 (USD); Case/Package: SOIC; Number of Pins: 16; Min Operating Temperature: -55°C; Max Operating Temperature: 125°C; Packaging: Rail/Tube; Data Rate: 100Mbps; Type: General Purpose; REACH SVHC: No SVHC; Lead Free: Lead Free; Supplier Part Number 1: 296-43869-5-ND
U7 U8 = LM3671MF-ADJ: IC REG BCK ADJ 0.6A SYNC SOT23-5; Manufacturer: Texas Instruments; Frequency: 2MHz; Number of Outputs: 1; Output Current: 600mA; Switching Frequency: 2.6MHz; Output Voltage: 3.3V; Quiescent Current: 1.7mA; Max Input Voltage: 5.5V; Min Supply Voltage: 2.7V; Min Output Voltage: 1.1V; Synchronous Rectifier: Yes; Supplier 1: Farnell; Manufacturer Part Number: LM3671MF-ADJ; Stock 1: 1509; Pricing 1: 1=0.575, 30=0.472, 80=0.43, 250=0.39, 500=0.304 (GBP); Mount: Surface Mount; Case/Package: SOT-23; Number of Pins: 5; Min Operating Temperature: -40°C; Max Operating Temperature: 85°C; Packaging: Tape and Reel; Package Quantity: 1000; Termination: SMD/SMT; Max Output Current: 600mA; Max Supply Voltage: 5.5V; Min Input Voltage: 2.7V; Max Output Voltage: 3.3V; Radiation Hardening: No; Lead Free: Contains Lead; REACH SVHC: No SVHC; ComponentLink1URL: https://datasheet.ciiva.com/12224/lm3671-12224984.pdf; ComponentLink1Description: https://datasheet.ciiva.com/12224/lm3671-12224984.pdf; ComponentLink2URL: https://datasheet.ciiva.com/14304/lm3671-14304698.pdf; ComponentLink2Description: https://datasheet.ciiva.com/14304/lm3671-14304698.pdf; Supplier Part Number 1: 1008256
U9 = CP2102N-A01-GQFN28: SILICON LABS         CP2102N-A01-GQFN28             Interface Bridges, USB to UART, 3 V, 3.6 V, QFN, 28 Pins, -40 C                          New; Min Supply Voltage: 3V; Max Supply Voltage: 3.6V; Supplier 1: Farnell; Manufacturer: Silicon Labs; Manufacturer Part Number: CP2102N-A01-GQFN28; Stock 1: 729; Pricing 1: 1=1.31, 10=1.2, 25=1.11, 50=1.09, 100=1.07, 250=1.05, 500=1.03, 1000=1.01 (GBP); Case/Package: QFN; Number of Pins: 28; Min Operating Temperature: -40°C; Max Operating Temperature: 85°C; REACH SVHC: Unknown; Supplier Part Number 1: 2577279; ComponentLink1Description: Datasheet; ComponentLink1URL: https://www.silabs.com/documents/public/data-sheets/cp2102n-datasheet.pdf; ComponentLink2Description: Reference design; ComponentLink2URL: https://download.mikroe.com/documents/add-on-boards/click/usb-uart-3/usb-3-uart-click-schematic-v100.pdf
U10 = USBLC6-2SC6: TVS DIODE 5.25VWM 17VC SOT23-6; Manufacturer: STMicroelectronics; Polarity: Bidirectional,Unidirectional; Data Rate: 480Mbps; Capacitance: 3.5pF; Operating Supply Voltage: 1.1V; Number of Elements: 1; Number of Channels: 2; Reverse Breakdown Voltage: 6V; Clamping Voltage: 17V; Working Voltage: 5V; Reverse Standoff Voltage: 5.25V; Power Line Protection: Yes; Test Current: 1mA; Max Reverse Leakage Current: 150nA; Peak Pulse Current: 5A; Element Configuration: Dual; Supplier 1: Farnell; Manufacturer Part Number: USBLC6-2SC6; Stock 1: 40838; Pricing 1: 5=0.327, 50=0.216, 100=0.165, 500=0.155, 1500=0.145 (GBP); Mount: Surface Mount; Case/Package: SOT-23; Number of Pins: 6; Contact Plating: Matte,Tin; Min Operating Temperature: -40°C; Max Operating Temperature: 125°C; Package Quantity: 3000; Packaging: Tape and Reel; Direction: Bidirectional,Unidirectional; Breakdown Voltage: 6V; Termination: SMD/SMT; Number of Bidirectional Channels: 2; Min Breakdown Voltage: 6V; ESD Protection: Yes; Max Breakdown Voltage: 6V; Leakage Current: 150nA; Length: 3.05mm; Height: 1.3mm; Width: 1.75mm; Depth: 1.75mm; Radiation Hardening: No; Lead Free: Lead Free; REACH SVHC: No SVHC; ComponentLink1URL: http://www.farnell.com/datasheets/1690354.pdf; ComponentLink1Description: http://www.farnell.com/datasheets/1690354.pdf; ComponentLink2URL: http://www.st.com/content/ccc/resource/technical/document/datasheet/06/1d/48/9c/6c/20/4a/b2/CD00050750.pdf/files/CD00050750.pdf/jcr:content/translations/en.CD00050750.pdf; ComponentLink2Description: http://www.st.com/content/ccc/resource/technical/document/datasheet/06/1d/48/9c/6c/20/4a/b2/CD00050750.pdf/files/CD00050750.pdf/jcr:content/translations/en.CD00050750.pdf; ComponentLink3URL: http://www.st.com/web/en/resource/technical/document/datasheet/CD00050750.pdf; ComponentLink3Description: http://www.st.com/web/en/resource/technical/document/datasheet/CD00050750.pdf; ComponentLink4URL: http://datasheet.iiic.cc/stmicroelectronics/USBLC6-2SC6.pdf; ComponentLink4Description: http://datasheet.iiic.cc/stmicroelectronics/USBLC6-2SC6.pdf; ComponentLink5URL: http://www.produktinfo.conrad.com/datenblaetter/1100000-1199999/001184109-da-01-en-IC_ESD_PROTECTI_USBLC6_2SC6_SOT_23_6_STM.pdf; ComponentLink5Description: http://www.produktinfo.conrad.com/datenblaetter/1100000-1199999/001184109-da-01-en-IC_ESD_PROTECTI_USBLC6_2SC6_SOT_23_6_STM.pdf; Supplier Part Number 1: 1269406
U11 = R05P23.3S/R8: RECOM POWER         R05P23.3S/R8            Isolated Board Mount DC/DC Converter, Medical, Fixed, 1 Output, 4.5 V, 5.5 V, 2 W, 3.3 V; Nominal Input Voltage: 5V; Number of Outputs: 1; Output Power: 2W; Min Input Voltage: 4.5V; Max Input Voltage: 5.5V; Max Output Current: 600mA; Output Voltage: 3.3V; Efficiency: 78%; Isolation Voltage: 8kV; Supplier 1: Digi-Key; Manufacturer: Recom; Manufacturer Part Number: R05P23.3S/R8; Stock 1: 0; Mount: Through Hole; Case/Package: SIP; Number of Pins: 4; Weight: 4.3g; Min Operating Temperature: -40°C; Max Operating Temperature: 85°C; Packaging: Rail/Tube; Output Current: 600mA; Min Input Voltage (DC): 4.5V; Package Quantity: 25; Voltage - Output 1: 3.3V; Max Input Voltage (DC): 5.5V; Max Output Power: 2W; Current - Output 1: 600mA; Isolation: Isolated; Max Power Dissipation: 2W; Max Output Voltage: 3.3V; Length: 19.5mm; Height: 12.5mm; Width: 9.8mm; Depth: 9.8mm; REACH SVHC: No SVHC; Lead Free: Lead Free; ComponentLink1URL: http://www.farnell.com/datasheets/1776690.pdf; ComponentLink1Description: http://www.farnell.com/datasheets/1776690.pdf; ComponentLink2URL: https://www.recom-power.com/pdf/Econoline/RxxP2xx_R.pdf; ComponentLink2Description: https://www.recom-power.com/pdf/Econoline/RxxP2xx_R.pdf; Supplier Part Number 1: 1486-R05P23.3S/R8-CHP
U12 = NCP703SN28T1G: LDO Voltage Regulators 300mA Lo Quiescent Crnt LDO Reg; Manufacturer: ON Semiconductor; Dropout Voltage: 180mV; Max Input Voltage: 5.5V; Output Voltage: 2.8V; Min Input Voltage: 2V; Number of Outputs: 1; Max Output Current: 750mA; Min Current Limit: 310mA; Quiescent Current: 20uA; Polarity: Positive; Accuracy: 2%; Power Supply Rejection Ratio (PSRR): 70dB; Output Type: Fixed; Supplier 1: Digi-Key; Manufacturer Part Number: NCP703SN28T1G; Stock 1: 3338; Pricing 1: 1=0.8, 10=0.707, 100=0.542, 500=0.42848, 1000=0.34278 (USD); Mount: Surface Mount; Case/Package: TSOP; Number of Pins: 5; Min Operating Temperature: -40°C; Max Operating Temperature: 125°C; Package Quantity: 3000; Packaging: Tape and Reel; Output Current: 300mA; Number of Regulators: 1; Nominal Output Voltage: 2.8V; Length: 3mm; Height: 1mm; Width: 1.5mm; Radiation Hardening: No; REACH SVHC: No SVHC; Lead Free: Lead Free; Halogen Free: Halogen Free; ComponentLink1URL: http://www.onsemi.com/pub/Collateral/NCP703-D.PDF; ComponentLink1Description: http://www.onsemi.com/pub/Collateral/NCP703-D.PDF; Supplier Part Number 1: NCP703SN28T1GOSCT-ND
U13 = DMG6602SVT: DIODES INC. - DMG6602SVT - MOSFET, NP CH, , 30V, 3.4, ATSOT23; Transistor Polarity: N and P Channel; Continuous Drain Current Id: 3.4; Drain Source Voltage Vds: 30; On Resistance Rds(on): 0.038; Rds(on) Test Voltage Vgs: 10; Threshold Voltage Vgs: 1; Power Dissipation Pd: 1.12; Transistor Case Style: TSOT-26; No. of Pins: 6; SVHC: No SVHC (17-Dec-2015); Continuous Drain Current Id, P Channel: -2.8; Drain Source Voltage Vds, P Channel: -30; Module Configuration: Dual; On Resistance Rds(on), P Channel: 0.073; Supplier 1: Farnell; Manufacturer: DIODES INC.; Manufacturer Part Number: DMG6602SVT; RoHS: YES; Stock 1: 4881; Pricing 1: 1=0.363, 25=0.339, 100=0.169, 250=0.166, 500=0.108, 1000=0.0809, 2000=0.0793, 6000=0.0777 (GBP); Operating Temperature Max: 150; Product Range: -; Automotive Qualification Standard: -; MSL: -; Continuous Drain Current Id, N Channel: 3.4; Drain Source Voltage Vds, N Channel: 30; On Resistance Rds(on), N Channel: 0.038; Operating Temperature Min: -55; Operating Temperature Range: -55°C to +150°C<!--FANDB--><div class="features-and-benefits-container"><div class="features-and-benefits-description"><span class="features-benefits-value">The DMG6602SVT from Diode Inc is a surface mount complementary pair enhancement mode MOSFET in TSOT-26 package. This MOSFET features low input capacitance, fast switching speed and low input/output leakage, designed to minimize the onstate resistance and maintain superior switching performance, making it ideal for high efficiency power management applications and backlighting.</span></div><div class="features-and-benefits-list"><ul class="features-and-benefits-list-list"><li class="features-and-benefits-list-item">Automotive grade AEC-Q101 qualified</li><li class="features-and-benefits-list-item">UL recognized</li><li class="features-and-benefits-list-item">Drain to source voltage (Vds) of 30V</li><li class="features-and-benefits-list-item">Gate to source voltage (Vgs) of ±20V</li><li class="features-and-benefits-list-item">Continuous drain current of 3.4A</li><li class="features-and-benefits-list-item">Power dissipation (Pd) of 1.27W</li><li class="features-and-benefits-list-item">Operating temperature range -55°C to 150°C</li><li class="features-and-benefits-list-item">Low on state resistance of 38mohm at Vgs of 10; ComponentLink1URL: http://www.farnell.com/datasheets/1915929.pdf; ComponentLink1Description: http://www.farnell.com/datasheets/1915929.pdf; Supplier Part Number 1: 2061522
J1-J6 = Socket: LatestRevisionDate: 17-Jul-2002; LatestRevisionNote: Re-released for DXP Platform.; Publisher: Altium Limited